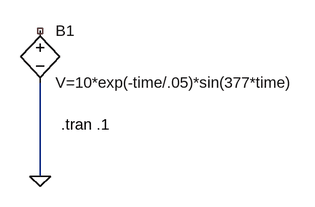
[diagram p0: schematic arbitrary_voltage_source_decay.asc]
arbitrary_voltage_source_decay.asc, the LTspice schematic file:
Version 4
SHEET 1 880 680
WIRE 240 144 240 0
FLAG 240 144 0
SYMBOL bv 240 -96 R0
SYMATTR InstName B1
SYMATTR Value V=10*exp(-time/.05)*sin(377*time)
TEXT 272 64 Left 2 !.tran .1

The netlist it stands for:
* arbitrary_voltage_source_decay.asc
B1 NC_01 0 V=10*exp(-time/.05)*sin(377*time)
.tran .1
.backanno
.end